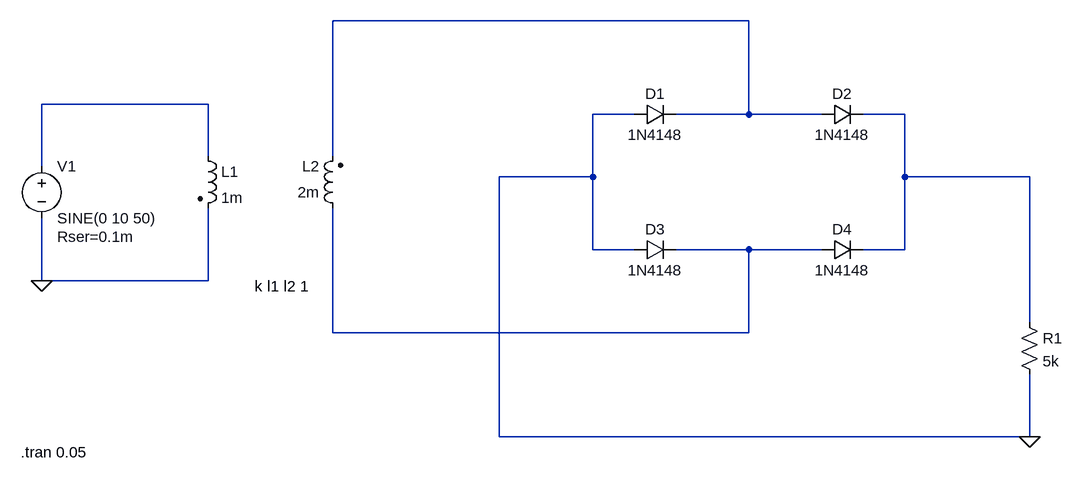
[diagram p0: schematic full-wave.asc]
full-wave.asc, the LTspice schematic file:
Version 4
SHEET 1 1576 680
WIRE 1088 -96 448 -96
WIRE 256 32 0 32
WIRE 912 48 848 48
WIRE 1088 48 1088 -96
WIRE 1088 48 976 48
WIRE 1200 48 1088 48
WIRE 1328 48 1264 48
WIRE 256 112 256 32
WIRE 448 112 448 -96
WIRE 0 128 0 32
WIRE 848 144 848 48
WIRE 848 144 704 144
WIRE 1328 144 1328 48
WIRE 1520 144 1328 144
WIRE 848 256 848 144
WIRE 912 256 848 256
WIRE 1088 256 976 256
WIRE 1200 256 1088 256
WIRE 1328 256 1328 144
WIRE 1328 256 1264 256
WIRE 0 304 0 208
WIRE 256 304 256 192
WIRE 256 304 0 304
WIRE 1520 368 1520 144
WIRE 448 384 448 192
WIRE 1088 384 1088 256
WIRE 1088 384 448 384
WIRE 704 544 704 144
WIRE 1520 544 1520 448
WIRE 1520 544 704 544
FLAG 1520 544 0
FLAG 0 304 0
SYMBOL voltage 0 112 R0
WINDOW 123 0 0 Left 0
WINDOW 39 24 124 Left 2
SYMATTR InstName V1
SYMATTR Value SINE(0 10 50)
SYMATTR SpiceLine Rser=0.1m
SYMBOL ind2 240 96 R0
SYMATTR InstName L1
SYMATTR Value 1m
SYMATTR Type ind
SYMBOL ind2 464 208 R180
WINDOW 0 36 80 Left 2
WINDOW 3 36 40 Left 2
SYMATTR InstName L2
SYMATTR Value 2m
SYMATTR Type ind
SYMBOL diode 912 64 R270
WINDOW 0 32 32 VTop 2
WINDOW 3 0 32 VBottom 2
SYMATTR InstName D1
SYMATTR Value 1N4148
SYMBOL diode 1200 64 R270
WINDOW 0 32 32 VTop 2
WINDOW 3 0 32 VBottom 2
SYMATTR InstName D2
SYMATTR Value 1N4148
SYMBOL diode 912 272 R270
WINDOW 0 32 32 VTop 2
WINDOW 3 0 32 VBottom 2
SYMATTR InstName D3
SYMATTR Value 1N4148
SYMBOL diode 1200 272 R270
WINDOW 0 32 32 VTop 2
WINDOW 3 0 32 VBottom 2
SYMATTR InstName D4
SYMATTR Value 1N4148
SYMBOL res 1504 352 R0
SYMATTR InstName R1
SYMATTR Value 5k
TEXT 328 312 Left 2 !k l1 l2 1
TEXT -32 568 Left 2 !.tran 0.05

The netlist it stands for:
* full-wave.asc
V1 N002 0 SINE(0 10 50) Rser=0.1m
L1 N002 0 1m
L2 N004 N001 2m
D1 0 N001 1N4148
D2 N001 N003 1N4148
D3 0 N004 1N4148
D4 N004 N003 1N4148
R1 N003 0 5k
.model D D
.lib standard.dio
k l1 l2 1
.tran 0.05
.backanno
.end